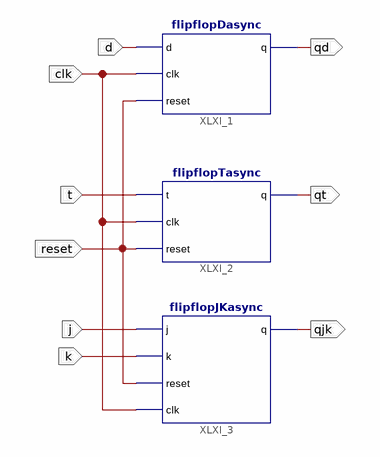
[diagram p0: schematic sheet 1]
// Xilinx ISE schematic main.sch (spartan3e) as structural Verilog: 3 symbols, 9 ports
module main (
  input  d,
  input  clk,
  input  reset,
  input  t,
  input  j,
  input  k,
  output qjk,
  output qt,
  output qd
);

  flipflopDasync XLXI_1 (.d(d), .clk(clk), .reset(reset), .q(qd));
  flipflopTasync XLXI_2 (.t(t), .clk(clk), .reset(reset), .q(qt));
  flipflopJKasync XLXI_3 (.j(j), .k(k), .reset(reset), .clk(clk), .q(qjk));
endmodule
